# Altium schematic sheet STM32.SchDoc
size A4
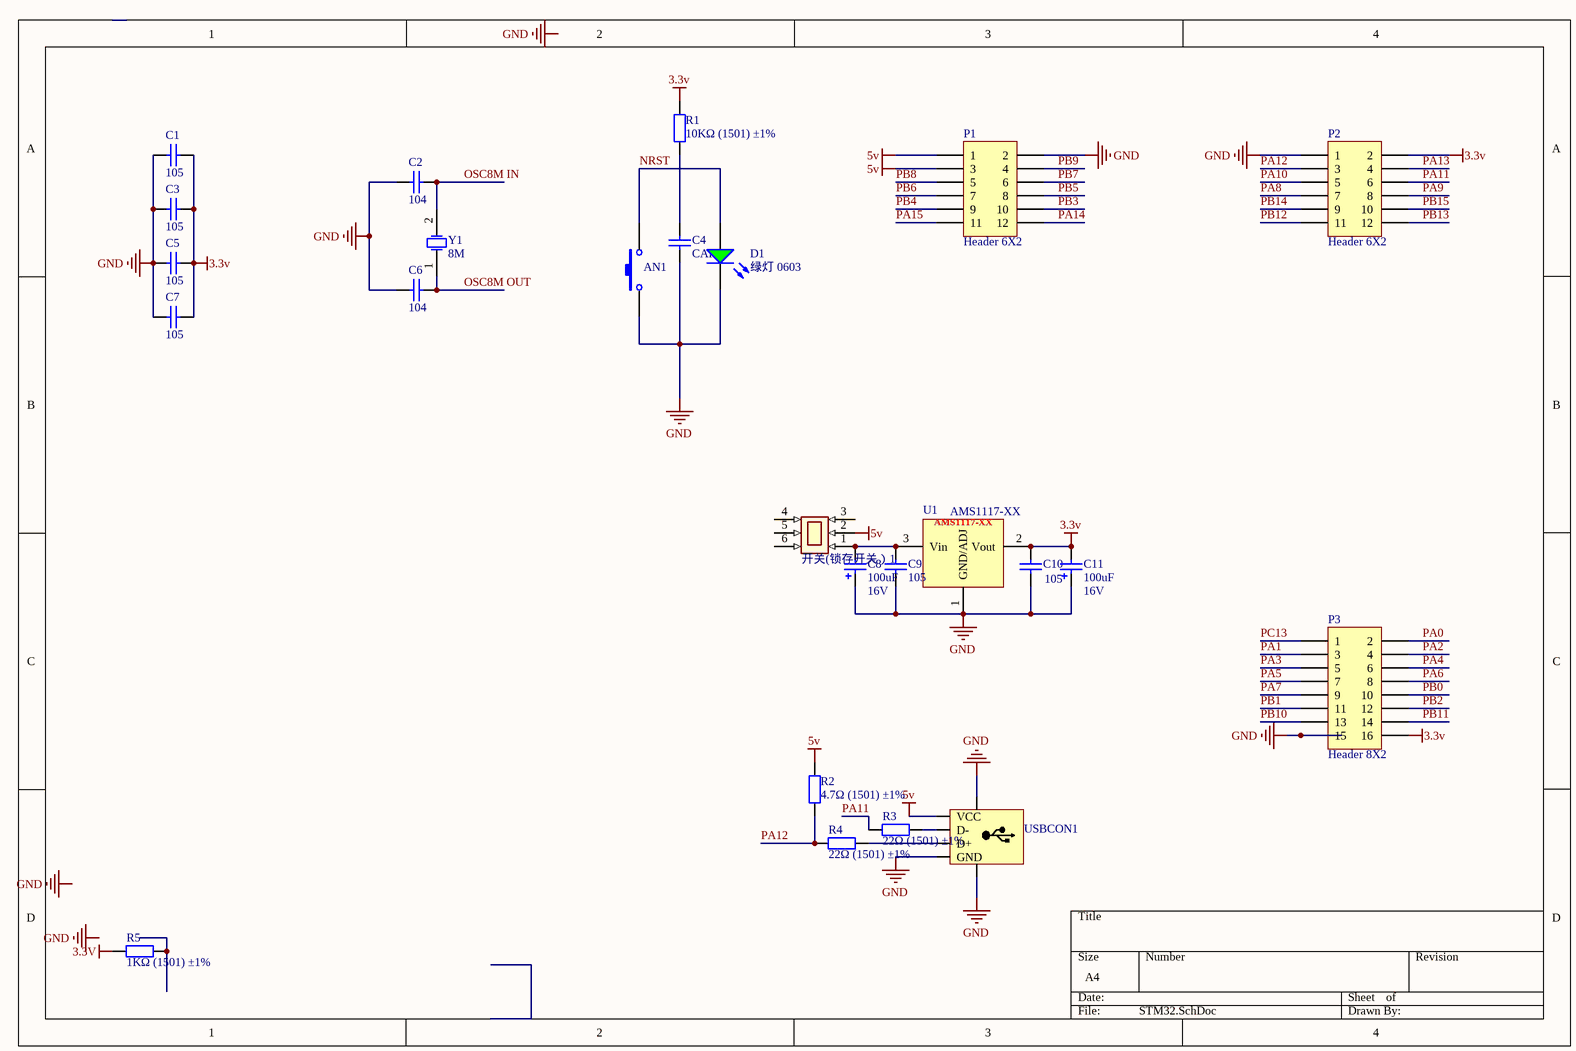
[diagram p0: STM32.SchDoc]

## Parts
AN1  Button  [BUTTON-DIP]  (value not drawn)
C1  value 105  [C0603]  (hidden comment: Cap Chip 0603)
C2  value 104  [C0603]  (hidden comment: Cap Chip 0603)
C3  value 105  [C0603]  (hidden comment: Cap Chip 0603)
C4  value CAP  [C0603]  (hidden comment: Cap Chip 0603)
C5  value 105  [C0603]  (hidden comment: Cap Chip 0603)
C6  value 104  [C0603]  (hidden comment: Cap Chip 0603)
C7  value 105  [C0603]  (hidden comment: Cap Chip 0603)
C8  value 100uF  Voltage: 16V  [CAPPR2.5-6.3X11]  (hidden comment: Cap Pol 2.5x6.3)
C9  value 105  [C0603]  (hidden comment: Cap Chip 0603)
C10  value 105  [C0603]  (hidden comment: Cap Chip 0603)
C11  value 100uF  Voltage: 16V  [CAPPR2.5-6.3X11]  (hidden comment: Cap Pol 2.5x6.3)
D1  绿灯 0603  [LC-0603_LED_S1]
P1  Header 6X2  [HDR2X6]
P2  Header 6X2  [HDR2X6]
P3  Header 8X2  [HDR2X8]
R1  10KΩ (1501) ±1%  [LC-0402_R]
R2  4.7Ω (1501) ±1%  [LC-0402_R]
R3  22Ω (1501) ±1%  [LC-0402_R]
R4  22Ω (1501) ±1%  [LC-0402_R]
R5  1KΩ (1501) ±1%  [LC-0402_R]
U1  AMS1117-XX  [SOT-223-4]
USBCON1  USB-4P  [USB-A-SMT]  (value not drawn)
Y1  8M  [LC-SMD-5032_2P]
开关(锁存开关）1  开关(锁存开关）  [开关(锁存开关）]  (value not drawn)

## Nets
3.3V: C1.2 C3.2 C5.2 C7.2 C10.2 C11.2 P2.2 P3.16 R1.2 R5.1 U1.2(Vout)
5v: P1.1 P1.3 R2.2 USBCON1.1(VCC) 开关(锁存开关）1.2
GND: AN1.2 C1.1 C2.1 C3.1 C4.1 C5.1 C6.1 C7.1 C8.1 C9.1 C10.1 C11.1 D1.K P1.2 P2.1 P3.15 U1.1(GND/ADJ) USBCON1.4(GND) USBCON1.5(GND) USBCON1.6(GND)
NRST: AN1.1 D1.A
OSC8M IN: C2.2 Y1.2(OSC2)
OSC8M OUT: C6.2 Y1.1(OSC1)
PA0: P3.2
PA1: P3.3
PA2: P3.4
PA3: P3.5
PA4: P3.6
PA5: P3.7
PA6: P3.8
PA7: P3.9
PA8: P2.7
PA9: P2.8
PA10: P2.5
PA11: P2.6 R3.1
PA12: P2.3 R2.1 R4.1
PA13: P2.4
PA14: P1.12
PA15: P1.11
PB0: P3.10
PB1: P3.11
PB2: P3.12
PB3: P1.10
PB4: P1.9
PB5: P1.8
PB6: P1.7
PB7: P1.6
PB8: P1.5
PB9: P1.4
PB10: P3.13
PB11: P3.14
PB12: P2.11
PB13: P2.12
PB14: P2.9
PB15: P2.10
PC13: P3.1
NetC4_2: C4.2 R1.1
NetC8_2: C8.2 C9.2 U1.3(Vin) 开关(锁存开关）1.1
NetR3_2: R3.2 USBCON1.2(D-)
NetR4_2: R4.2 USBCON1.3(D+)

Not connected (* = marked no-connect by the designer): R5 2; 开关(锁存开关）1 3 4 5 6

## Notes on the sheet
- Labels drawn without touching a wire or pin: GND

## Library data of the parts
C1-C7 C9 C10 = Cap Chip 0603: Polarized Capacitor (Radial); Published: 8-Jun-2000; Revision: July-2002: Re-released for DXP Platform.; Publisher: Altium Limited
C8 C11 = Cap Pol 2.5x6.3: Polarized Capacitor (Radial); Published: 8-Jun-2000; Revision: July-2002: Re-released for DXP Platform.; Publisher: Altium Limited
D1 = 0603 绿灯: 发光二极管; ComponentLink1Description: 供应商链接; ComponentLink1URL: http://www.szlcsc.com/product/details_73152.html; Package: 0603; Supplier: LC; SuppliersPartNumber: C72043
P1 P2 = Header 6X2: Header, 6-Pin, Dual row; LatestRevisionDate: 17-Jul-2002; LatestRevisionNote: Re-released for DXP Platform.; Publisher: Altium Limited
P3 = Header 8X2: Header, 8-Pin, Dual row; LatestRevisionDate: 17-Jul-2002; LatestRevisionNote: Re-released for DXP Platform.; Publisher: Altium Limited
R1-R5 = 0402 1.5KΩ (1501) 1%: 贴片电阻; ComponentLink1Description: 供应商链接; ComponentLink1URL: http://www.szlcsc.com/product/details_26610.html; Package: 0402; Supplier: LC; SuppliersPartNumber: C25867
U1 = AMS1117-XX: AMS   800mA LOW DROPOUT VOLTAGE REGULATOR
USBCON1 = USB-4P: USB CONNECTOR
Y1 = SMD-5032_2P 8MHz 20ppm 20pF: 贴片晶振; ComponentLink1Description: 供应商链接; ComponentLink1URL: http://www.szlcsc.com/product/details_19261.html; Package: SMD-5032_2P; Supplier: LC; SuppliersPartNumber: C18560
AN1 = Button: Published: 24-Mar-1999; LatestRevisionDate: 17-Jul-2002; LatestRevisionNote: Re-released for DXP Platform.; PackageReference: SPST-2; Publisher: Altium Limited